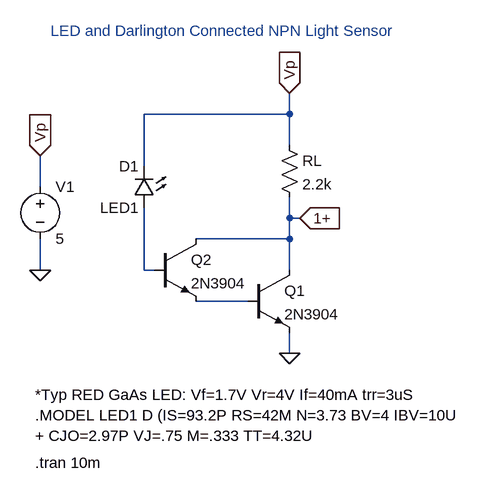
[diagram p0: schematic led_darlington_ltspice.asc]
led_darlington_ltspice.asc, the LTspice schematic file:
Version 4
SHEET 1 880 776
WIRE 528 224 528 192
WIRE 528 224 304 224
WIRE 528 272 528 224
WIRE 304 304 304 224
WIRE 144 336 144 288
WIRE 528 384 528 352
WIRE 544 384 528 384
WIRE 528 416 528 384
WIRE 528 416 384 416
WIRE 144 464 144 416
WIRE 304 464 304 368
WIRE 320 464 304 464
WIRE 528 464 528 416
WIRE 464 512 384 512
WIRE 528 592 528 560
FLAG 528 592 0
FLAG 528 192 Vp
IOPIN 528 192 In
FLAG 544 384 1+
IOPIN 544 384 In
FLAG 144 464 0
FLAG 144 288 Vp
IOPIN 144 288 In
SYMBOL res 512 256 R0
SYMATTR InstName RL
SYMATTR Value 2.2k
SYMBOL npn 464 464 R0
SYMATTR InstName Q1
SYMATTR Value 2N3904
SYMBOL npn 320 416 R0
SYMATTR InstName Q2
SYMATTR Value 2N3904
SYMBOL LED 320 368 R180
WINDOW 0 24 64 Left 2
WINDOW 3 24 0 Left 2
SYMATTR InstName D1
SYMATTR Value LED1
SYMBOL voltage 144 320 R0
WINDOW 123 0 0 Left 0
WINDOW 39 0 0 Left 0
SYMATTR InstName V1
SYMATTR Value 5
TEXT 160 96 Left 2 ;LED and Darlington Connected NPN Light Sensor
TEXT 136 656 Left 2 !*Typ RED GaAs LED: Vf=1.7V Vr=4V If=40mA trr=3uS\n.MODEL LED1 D (IS=93.2P RS=42M N=3.73 BV=4 IBV=10U\n+ CJO=2.97P VJ=.75 M=.333 TT=4.32U
TEXT 136 760 Left 2 !.tran 10m

The netlist it stands for:
* led_darlington_ltspice.asc
RL Vp 1+ 2.2k
Q1 1+ N002 0 0 2N3904
Q2 1+ N001 N002 0 2N3904
D1 N001 Vp LED1
V1 Vp 0 5
.model D D
.lib standard.dio
.model NPN NPN
.model PNP PNP
.lib standard.bjt
* LED and Darlington Connected NPN Light Sensor
*Typ RED GaAs LED: Vf=1.7V Vr=4V If=40mA trr=3uS
.MODEL LED1 D (IS=93.2P RS=42M N=3.73 BV=4 IBV=10U
+ CJO=2.97P VJ=.75 M=.333 TT=4.32U
.tran 10m
.backanno
.end